# Altium schematic sheet Resistive_Unequal_Power_Divider.SchDoc
size A4; CompanyName: WEITI ISE; Address1: ul. Nowowiejska 15/19; Address2: 00-665 Warszawa; DocumentNumber: 6; SheetNumber: 6; SheetTotal: 11
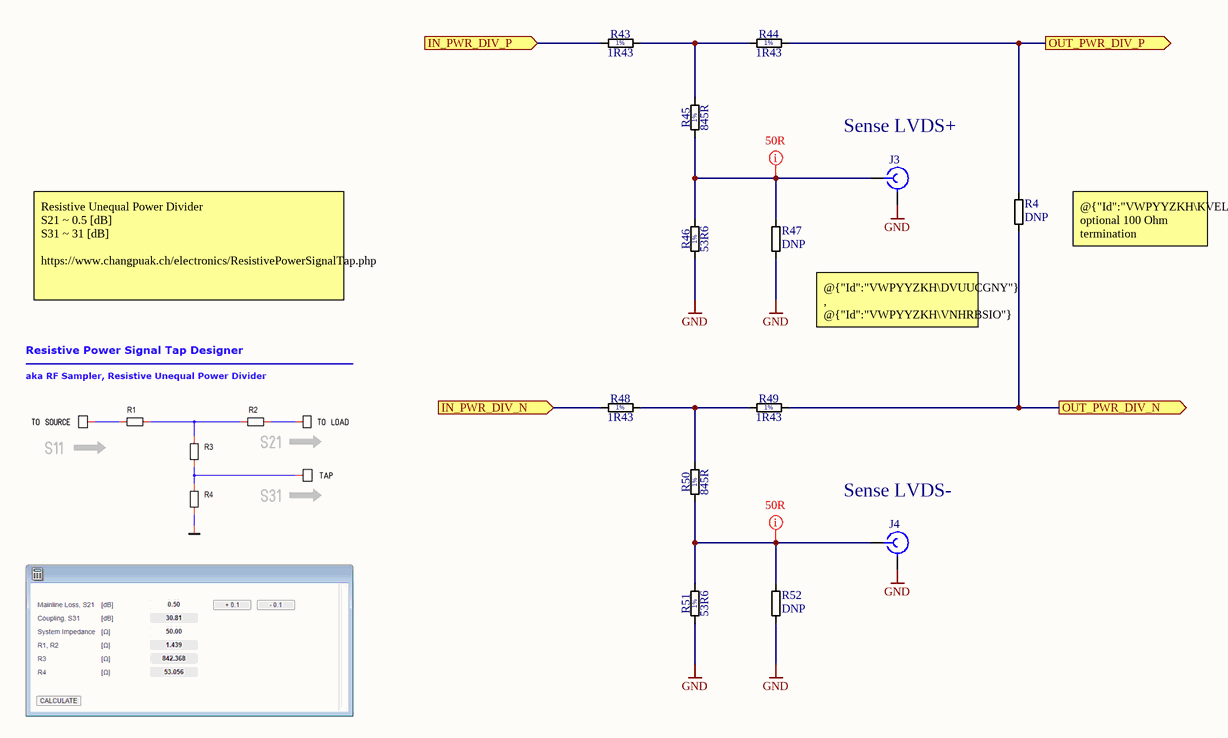
[diagram p0: Resistive_Unequal_Power_Divider.SchDoc]

## Parts
J3  901-144-8RFX  [901-144-8RFX]  (value not drawn)
J4  901-144-8RFX  [901-144-8RFX]  (value not drawn)
R4  DNP  [RESC0402X40N]
R43  1R43  [RESC0402X40N]
R44  1R43  [RESC0402X40N]
R45  845R  [RESC0402X40N]
R46  53R6  [RESC0402X40N]
R47  DNP  [RESC0402X40N]
R48  1R43  [RESC0402X40N]
R49  1R43  [RESC0402X40N]
R50  845R  [RESC0402X40N]
R51  53R6  [RESC0402X40N]
R52  DNP  [RESC0402X40N]

## Ports
IN_PWR_DIV_N (in), IN_PWR_DIV_P (in), OUT_PWR_DIV_N (out), OUT_PWR_DIV_P (out)

## Nets
GND: J3.2 J4.2 R46.1 R47.1 R51.1 R52.1
IN_PWR_DIV_N: R48.1 ; port IN_PWR_DIV_N
IN_PWR_DIV_P: R43.1 ; port IN_PWR_DIV_P
OUT_PWR_DIV_N: R4.1 R49.2 ; port OUT_PWR_DIV_N
OUT_PWR_DIV_P: R4.2 R44.2 ; port OUT_PWR_DIV_P
NetJ3_1: J3.1 R45.1 R46.2 R47.2
NetJ4_1: J4.1 R50.1 R51.2 R52.2
NetR43_2: R43.2 R44.1 R45.2
NetR48_2: R48.2 R49.1 R50.2

## Layout directives
net class SE50; CompClassName: SE50_LINE: NetJ3_1, NetJ4_1

## Notes on the sheet
- (near J3) Sense LVDS+
- Resistive Unequal Power Divider
  S21 ~ 0.5 [dB]
  S31 ~ 31 [dB]
  https://www.changpuak.ch/electronics/ResistivePowerSignalTap.php
- @{"Id":"VWPYYZKH\KVELIYVL"} optional 100 Ohm termination
- @{"Id":"VWPYYZKH\DVUUCGNY"} , @{"Id":"VWPYYZKH\VNHRBSIO"} optional 50 Ohm termination
- (near J4) Sense LVDS-
- Project:
- Title
- File:
- Drawn by:
- Engineer:
- Checked by:
- Szymon Jedliński
- Sheet:
- Revision:
- Total Sheet:
- 1.0
- Variant:
- Approved by:
- Date:

## Library data of the parts
J3 J4 = 901-144-8RFX: Coaxial Connectors VERTICAL PCB JACK GOLD PLATED BRASS; Manufacturer 1 Component Height: 9.53mm; DesignItemId: 901-144-8RFX; HelpURL: https://www.mouser.pl/datasheet/2/18/1/amph_s_a0001295158_1-2260876.pdf; Manufacturer Part Number: 901-144-8RFX; SMD: No
R4 R47 R52 = R0402_DNP: General Purpose Thick Film Chip Resistor; Manufacturer 1 Component Height: 0.4mm; Voltage: 50V; DesignItemId: R0402_DNP; HelpURL: https://www.vishay.com/docs/20035/dcrcwe3.pdf; SMD: Yes; Value: DNP
R43 R44 R48 R49 = R0402_1R43_0.0625W_100PPM: General Purpose Thick Film Chip Resistor; Manufacturer Part Number: CRCW04021R43FKED; Manufacturer 1 Component Height: 0.4mm; Tolerance: 1%; Voltage: 50V; DesignItemId: R0402_1R43_0.0625W_100PPM; HelpURL: https://www.vishay.com/docs/20035/dcrcwe3.pdf; SMD: Yes; Value: 1R43
R45 R50 = R0402_845R_0.0625W_100PPM: General Purpose Thick Film Chip Resistor; Manufacturer Part Number: RC0402FR-07845RL; Manufacturer 1 Component Height: 0.4mm; Tolerance: 1%; Voltage: 50V; DesignItemId: R0402_845R_0.0625W_100PPM; HelpURL: https://www.mouser.pl/datasheet/2/447/PYu_RC_Group_51_RoHS_L_11-1984063.pdf; SMD: Yes; Value: 845R
R46 R51 = R0402_53R6_0.0625W_100PPM: General Purpose Thick Film Chip Resistor; Manufacturer Part Number: RC0402FR-0753R6L; Manufacturer 1 Component Height: 0.4mm; Tolerance: 1%; Voltage: 50V; DesignItemId: R0402_53R6_0.0625W_100PPM; HelpURL: https://www.mouser.pl/datasheet/2/447/PYu_RC_Group_51_RoHS_L_11-1984063.pdf; SMD: Yes; Value: 53R6